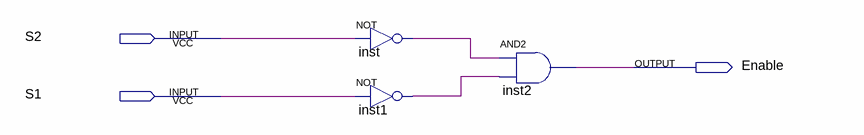
[diagram p0: schematic sheet]
// Quartus schematic enable-dec.bdf as structural Verilog: 3 symbols, 3 pins
module \enable-dec  (
  input  S2,
  input  S1,
  output Enable
);

  wire inst1_out, inst_out;

  not inst (inst_out, S2);
  not inst1 (inst1_out, S1);
  and inst2 (Enable, inst_out, inst1_out);
endmodule
